# Altium schematic sheet Sheet.SchDoc
size A4
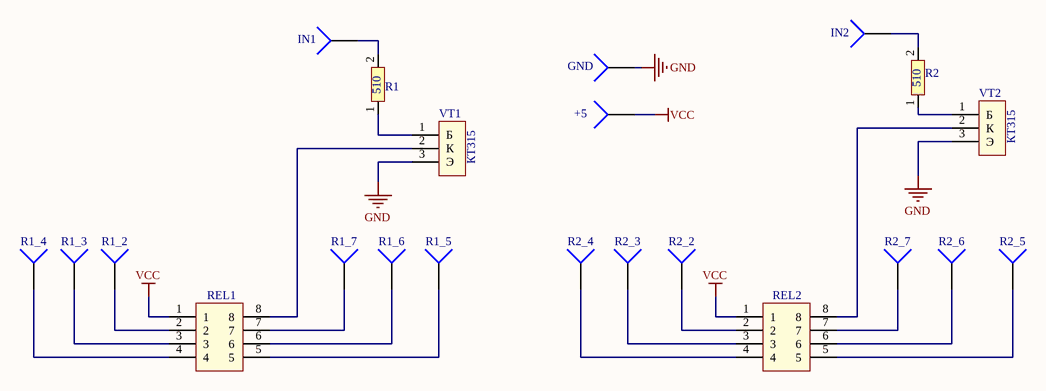
[diagram p0: Sheet.SchDoc]

## Parts
J1  IN2  [PIN1]
J2  IN1  [PIN1]
J3  GND  [PIN1]
J4  +5  [PIN1]
J5  R1_4  [PIN1]
J6  R1_3  [PIN1]
J7  R1_2  [PIN1]
J8  R1_7  [PIN1]
J9  R1_6  [PIN1]
J10  R1_5  [PIN1]
J11  R2_4  [PIN1]
J12  R2_3  [PIN1]
J13  R2_2  [PIN1]
J14  R2_7  [PIN1]
J15  R2_6  [PIN1]
J16  R2_5  [PIN1]
R1  510  [RES]
R2  510  [RES]
REL1  IM03TS  [IM03TS]  (value not drawn)
REL2  IM03TS  [IM03TS]  (value not drawn)
VT1  КТ315  [KT315]
VT2  КТ315  [KT315]

## Nets
GND: J3.1 VT1.3(Э) VT2.3(Э)
VCC: J4.1 REL1.1 REL2.1
NetJ1_1: J1.1 R2.2
NetJ2_1: J2.1 R1.2
NetJ5_1: J5.1 REL1.4
NetJ6_1: J6.1 REL1.3
NetJ7_1: J7.1 REL1.2
NetJ8_1: J8.1 REL1.7
NetJ9_1: J9.1 REL1.6
NetJ10_1: J10.1 REL1.5
NetJ11_1: J11.1 REL2.4
NetJ12_1: J12.1 REL2.3
NetJ13_1: J13.1 REL2.2
NetJ14_1: J14.1 REL2.7
NetJ15_1: J15.1 REL2.6
NetJ16_1: J16.1 REL2.5
NetR1_1: R1.1 VT1.1(Б)
NetR2_1: R2.1 VT2.1(Б)
NetREL1_8: REL1.8 VT1.2(К)
NetREL2_8: REL2.8 VT2.2(К)

## Library data of the parts
J1-J16 = Socket: LatestRevisionDate: 17-Jul-2002; LatestRevisionNote: Re-released for DXP Platform.; Publisher: Altium Limited
R1 R2 = RES